# Altium schematic sheet FPGA.SchDoc
size A3; SheetNumber: 2; SheetTotal: 9
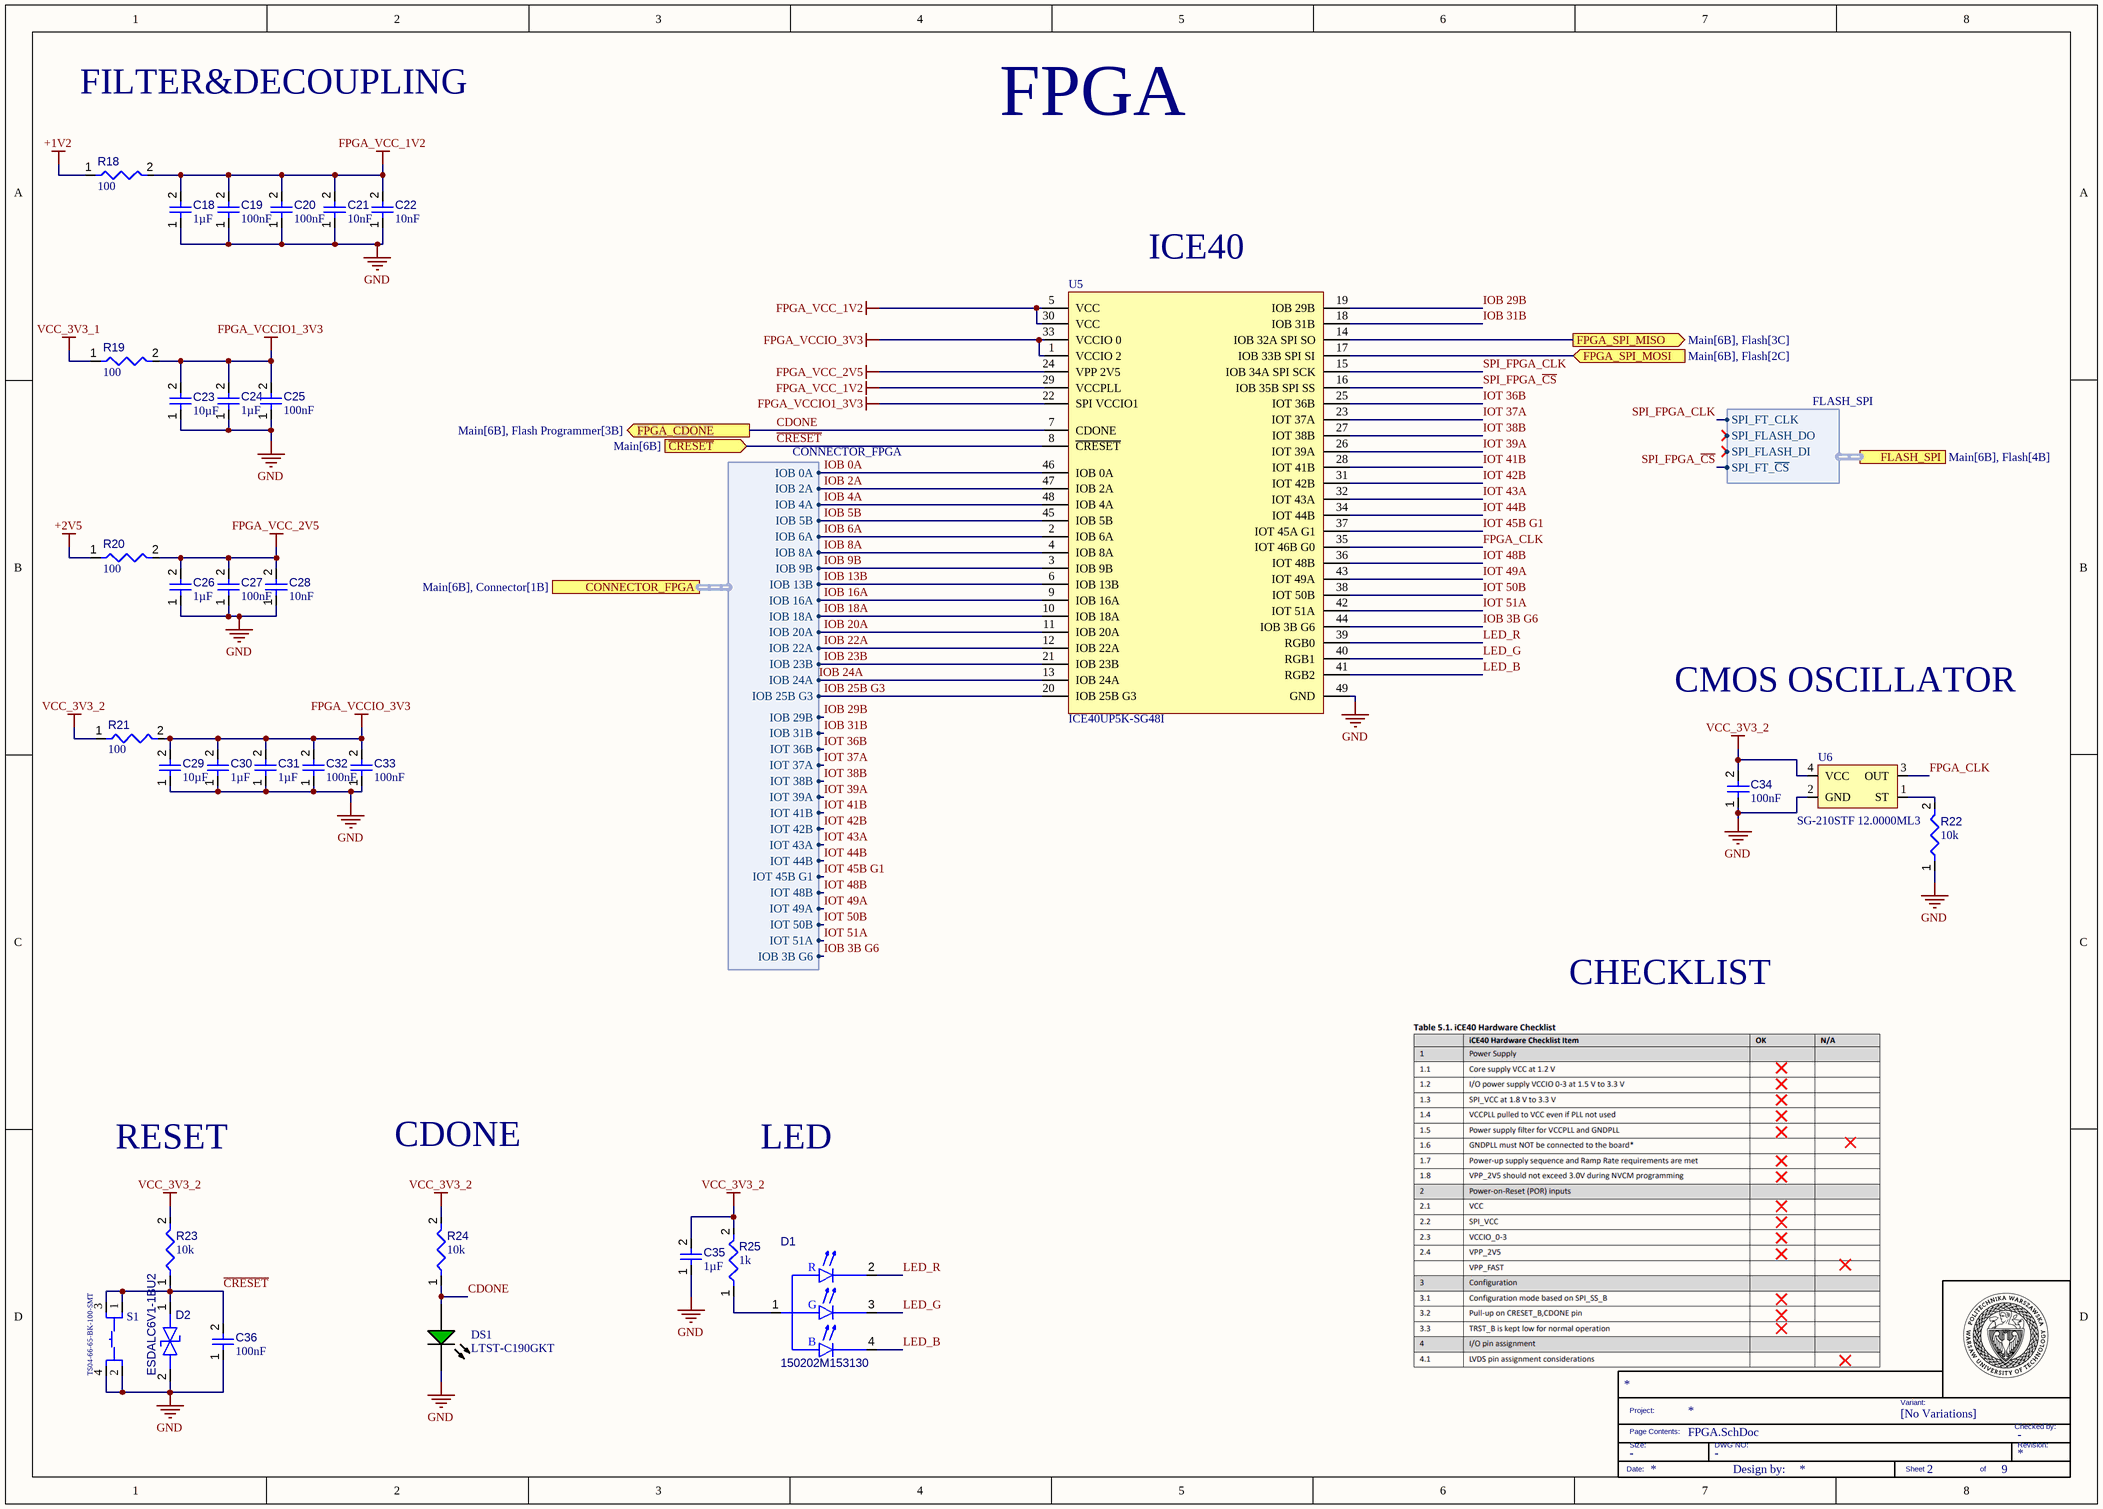
[diagram p0: FPGA.SchDoc]

## Parts
*?  TITLE_BLOCK  (value not drawn)  (graphical)
C18  value 1µF  [FP-CL10-IPC_C]  (hidden comment: CL10B105KA8NFNC)
C19  value 100nF  [FP-C0603C-CF-IPC_C]  (hidden comment: C0603C104K5RAC7411)
C20  value 100nF  [FP-C0603C-CF-IPC_C]  (hidden comment: C0603C104K5RAC7411)
C21  value 10nF  [CAPC1608X90X35LL10T15]  (hidden comment: GCM188R71H103KA37J)
C22  value 10nF  [CAPC1608X90X35LL10T15]  (hidden comment: GCM188R71H103KA37J)
C23  value 10µF  [FP-GRM188-0_2-IPC_C]  (hidden comment: GRM188R61C106MA73D)
C24  value 1µF  [FP-CL10-IPC_C]  (hidden comment: CL10B105KA8NFNC)
C25  value 100nF  [FP-C0603C-CF-IPC_C]  (hidden comment: C0603C104K5RAC7411)
C26  value 1µF  [FP-CL10-IPC_C]  (hidden comment: CL10B105KA8NFNC)
C27  value 100nF  [FP-C0603C-CF-IPC_C]  (hidden comment: C0603C104K5RAC7411)
C28  value 10nF  [CAPC1608X90X35LL10T15]  (hidden comment: GCM188R71H103KA37J)
C29  value 10µF  [FP-GRM188-0_2-IPC_C]  (hidden comment: GRM188R61C106MA73D)
C30  value 1µF  [FP-CL10-IPC_C]  (hidden comment: CL10B105KA8NFNC)
C31  value 1µF  [FP-CL10-IPC_C]  (hidden comment: CL10B105KA8NFNC)
C32  value 100nF  [FP-C0603C-CF-IPC_C]  (hidden comment: C0603C104K5RAC7411)
C33  value 100nF  [FP-C0603C-CF-IPC_C]  (hidden comment: C0603C104K5RAC7411)
C34  value 100nF  [FP-C0603C-CF-IPC_C]  (hidden comment: C0603C104K5RAC7411)
C35  value 1µF  [FP-CL10-IPC_C]  (hidden comment: CL10B105KA8NFNC)
C36  value 100nF  [FP-C0603C-CF-IPC_C]  (hidden comment: C0603C104K5RAC7411)
D1  150202M153130  [150202M153130-Footprint-1]
D2  ESDALC6V1-1BU2  [DIOC0603X03N]
DS1  LTST-C190GKT  [LTST-C190GKT_V]
R18  value 100  [RESC1608X06N]  (hidden comment: CRCW0603100RFKEAHP)
R19  value 100  [RESC1608X06N]  (hidden comment: CRCW0603100RFKEAHP)
R20  value 100  [RESC1608X06N]  (hidden comment: CRCW0603100RFKEAHP)
R21  value 100  [RESC1608X06N]  (hidden comment: CRCW0603100RFKEAHP)
R22  value 10k  [RESC1608X05N]  (hidden comment: CRCW060310K0FKTC)
R23  value 10k  [RESC1608X05N]  (hidden comment: CRCW060310K0FKTC)
R24  value 10k  [RESC1608X05N]  (hidden comment: CRCW060310K0FKTC)
R25  value 1k  [RESC1608X55X25LL10T15]  (hidden comment: Resistor 1k +/-1% 0603 100 mW)
S1  TS04-66-65-BK-100-SMT  [SW_TS04-66-65-BK-100-SMT]
U5  ICE40UP5K-SG48I  [FP-QFN-48-IPC_B]
U6  SG-210STF 12.0000ML3  [SG-210STF 12.0000ML3-Footprint-1]

## Ports
CONNECTOR_FPGA (harness CONNECTOR_FPGA, see Main[6B], Connector[1B]), FLASH_SPI (harness FLASH_SPI, see Main[6B], Flash[4B]), FPGA_CDONE (out, see Main[6B], Flash Programmer[3B]), FPGA_SPI_MISO (out, see Main[6B], Flash[3C]), FPGA_SPI_MOSI (in, see Main[6B], Flash[2C]), ~{CRESET} (in, see Main[6B])

## Harnesses
CONNECTOR_FPGA: IOB 0A, IOB 2A, IOB 4A, IOB 5B, IOB 6A, IOB 8A, IOB 9B, IOB 13B, IOB 16A, IOB 18A, IOB 20A, IOB 22A, IOB 23B, IOB 24A, IOB 25B G3, IOB 29B, IOB 31B, IOT 36B, IOT 37A, IOT 38B, IOT 39A, IOT 41B, IOT 42B, IOT 43A, IOT 44B, IOT 45B G1, IOT 48B, IOT 49A, IOT 50B, IOT 51A, IOB 3B G6
FLASH_SPI: SPI_FT_CLK, SPI_FLASH_DO, SPI_FLASH_DI, SPI_FT_~{CS}

## Nets
+1V2: R18.1
+2V5: R20.1
FPGA_VCC_1V2: C18.2 C19.2 C20.2 C21.2 C22.2 R18.2 U5.5(VCC) U5.29(VCCPLL) U5.30(VCC)
FPGA_VCC_2V5: C26.2 C27.2 C28.2 R20.2 U5.24(VPP_2V5)
FPGA_VCCIO1_3V3: C23.2 C24.2 C25.2 R19.2 U5.22(SPI_VCCIO1)
FPGA_VCCIO_3V3: C29.2 C30.2 C31.2 C32.2 C33.2 R21.2 U5.1(VCCIO_2) U5.33(VCCIO_0)
GND: C18.1 C19.1 C20.1 C21.1 C22.1 C23.1 C24.1 C25.1 C26.1 C27.1 C28.1 C29.1 C30.1 C31.1 C32.1 C33.1 C34.1 C35.1 C36.1 D2.2(A) DS1.2(K) R22.1 S1.2 S1.4 U5.49(GND) U6.2(GND)
VCC_3V3_1: R19.1
VCC_3V3_2: C34.2 C35.2 R21.1 R23.2 R24.2 R25.2 U6.4(VCC)
~{CRESET}: C36.2 D2.1(K) R23.1 S1.1 S1.3 U5.8(~{CRESET}) ; port ~{CRESET}
CDONE: DS1.1(A) R24.1 U5.7(CDONE) ; port FPGA_CDONE
FPGA_CLK: U5.35(IOT_46B_G0) U6.3(OUT)
FPGA_SPI_MISO: U5.14(IOB_32A_SPI_SO) ; port FPGA_SPI_MISO
FPGA_SPI_MOSI: U5.17(IOB_33B_SPI_SI) ; port FPGA_SPI_MOSI
IOB 0A: U5.46(IOB_0A) ; port CONNECTOR_FPGA.IOB 0A
IOB 2A: U5.47(IOB_2A) ; port CONNECTOR_FPGA.IOB 2A
IOB 3B G6: U5.44(IOB_3B_G6) ; port CONNECTOR_FPGA.IOB 3B G6
IOB 4A: U5.48(IOB_4A) ; port CONNECTOR_FPGA.IOB 4A
IOB 5B: U5.45(IOB_5B) ; port CONNECTOR_FPGA.IOB 5B
IOB 6A: U5.2(IOB_6A) ; port CONNECTOR_FPGA.IOB 6A
IOB 8A: U5.4(IOB_8A) ; port CONNECTOR_FPGA.IOB 8A
IOB 9B: U5.3(IOB_9B) ; port CONNECTOR_FPGA.IOB 9B
IOB 13B: U5.6(IOB_13B) ; port CONNECTOR_FPGA.IOB 13B
IOB 16A: U5.9(IOB_16A) ; port CONNECTOR_FPGA.IOB 16A
IOB 18A: U5.10(IOB_18A) ; port CONNECTOR_FPGA.IOB 18A
IOB 20A: U5.11(IOB_20A) ; port CONNECTOR_FPGA.IOB 20A
IOB 22A: U5.12(IOB_22A) ; port CONNECTOR_FPGA.IOB 22A
IOB 23B: U5.21(IOB_23B) ; port CONNECTOR_FPGA.IOB 23B
IOB 24A: U5.13(IOB_24A) ; port CONNECTOR_FPGA.IOB 24A
IOB 25B G3: U5.20(IOB_25B_G3) ; port CONNECTOR_FPGA.IOB 25B G3
IOB 29B: U5.19(IOB_29B) ; port CONNECTOR_FPGA.IOB 29B
IOB 31B: U5.18(IOB_31B) ; port CONNECTOR_FPGA.IOB 31B
IOT 36B: U5.25(IOT_36B) ; port CONNECTOR_FPGA.IOT 36B
IOT 37A: U5.23(IOT_37A) ; port CONNECTOR_FPGA.IOT 37A
IOT 38B: U5.27(IOT_38B) ; port CONNECTOR_FPGA.IOT 38B
IOT 39A: U5.26(IOT_39A) ; port CONNECTOR_FPGA.IOT 39A
IOT 41B: U5.28(IOT_41B) ; port CONNECTOR_FPGA.IOT 41B
IOT 42B: U5.31(IOT_42B) ; port CONNECTOR_FPGA.IOT 42B
IOT 43A: U5.32(IOT_43A) ; port CONNECTOR_FPGA.IOT 43A
IOT 44B: U5.34(IOT_44B) ; port CONNECTOR_FPGA.IOT 44B
IOT 45B G1: U5.37(IOT_45A_G1) ; port CONNECTOR_FPGA.IOT 45B G1
IOT 48B: U5.36(IOT_48B) ; port CONNECTOR_FPGA.IOT 48B
IOT 49A: U5.43(IOT_49A) ; port CONNECTOR_FPGA.IOT 49A
IOT 50B: U5.38(IOT_50B) ; port CONNECTOR_FPGA.IOT 50B
IOT 51A: U5.42(IOT_51A) ; port CONNECTOR_FPGA.IOT 51A
LED_B: D1.4(K) U5.41(RGB2)
LED_G: D1.3(K) U5.40(RGB1)
LED_R: D1.2(A) U5.39(RGB0)
SPI_FPGA_~{CS}: U5.16(IOB_35B_SPI_SS) ; port FLASH_SPI.SPI_FT_~{CS}
SPI_FPGA_CLK: U5.15(IOB_34A_SPI_SCK) ; port FLASH_SPI.SPI_FT_CLK
NetD1_1: D1.1(A) R25.1
NetR22_2: R22.2 U6.1(ST)

## Notes on the sheet
- FILTER&DECOUPLING
- FPGA
- (near U5) ICE40
- CMOS OSCILLATOR
- CHECKLIST
- RESET
- CDONE
- LED
- Rpullup=1/(2*ConfigFrequency*CDONETraceCap)
- CDONE IS 1 IF FPGA IS CONFIGURED
- (in symbol CMP-003-000005-7) Variant:; Project:; [No Variations]; Checked by:; Page Contents:; Size:; DWG NO:; Revision:; Date:; Design by:; Sheet; of
- (in symbol CMP-007-00037-1) R; G; B

## Library data of the parts
*? = CMP-003-000005-7: TITLEBLOCK; DWG NO: -; Size: -; Checked by: -; Design Item ID: TITLE_BLOCK; Source: TITLEBLOCK.SchLib
C18 C24 C26 C30 C31 C35 = CMP-001-00085-5: Ceramic Capacitor, Multilayer, Ceramic, 25V, 10% +Tol, 10% -Tol, X7R, 15% TC, 1uF, Surface Mount, 0603; Max Operating Temperature: 125°C; Pins: 2; RoHS Compliant: Yes; Min Operating Temperature: -55°C; Capacitor Type: Ceramic; Mounting Technology: Surface Mount; Case/Package: 0603
C19 C20 = CMP-001-00086-4: Ceramic Capacitor, Multilayer, Ceramic, 50V, 10% +Tol, 10% -Tol, X7R, 15% TC, 0.1uF, Surface Mount, 0603; Capacitor Type: Ceramic; Max Operating Temperature: 125°C; Case/Package: 0603; Pins: 2; Min Operating Temperature: -55°C; RoHS Compliant: Yes; Mounting Technology: Surface Mount
C21 C22 C28 = CMP-001-00231-2: Ceramic Capacitor, Multilayer, Ceramic, 50V, 10% +Tol, 10% -Tol, X7R, 15% TC, 0.01uF, Surface Mount, 0603; Min Operating Temperature: -55°C; Voltage Rating: 50V; Max Operating Temperature: 125°C; Tolerance: 10%; Capacitor Type: Ceramic; Mounting Technology: Surface Mount; RoHS Compliant: Yes; Case/Package: 0603; Pins: 2
C23 C29 = CMP-001-00241-5: Ceramic Capacitor, Multilayer, Ceramic, 16V, 20% +Tol, 20% -Tol, X5R, 15% TC, 10uF, Surface Mount, 0603; Min Operating Temperature: -55°C; Capacitor Type: Ceramic; RoHS Compliant: Yes; Max Operating Temperature: 85°C; Case/Package: 0603; Mounting Technology: Surface Mount; Pins: 2
C25 C27 C32-C34 C36 = CMP-001-00086-8: Ceramic Capacitor, Multilayer, Ceramic, 50V, 10% +Tol, 10% -Tol, X7R, 15% TC, 0.1uF, Surface Mount, 0603; Capacitor Type: Ceramic; Max Operating Temperature: 125°C; Case/Package: 0603; Pins: 2; Min Operating Temperature: -55°C; RoHS Compliant: Yes; Mounting Technology: Surface Mount
D1 = CMP-007-00037-1: Standard LEDs - SMD WL-SFTD Diffsd TopVw RGB 3.2V 20mA 635nm; Max Power Dissipation: 72mW; Min Operating Temperature: -40°C; Max Operating Temperature: 85°C; Pins: 4; Forward Voltage: 3.2V; Forward Current: 20mA; Colour: RGB; Nominal Vf: 3.2V
D2 = CMP-004-00032-2: Trans Voltage Suppressor Diode, Bidirectional, 1 Element, Silicon; Forward Current: 100nA; Peak Inverse Voltage: 6.1V; Forward Voltage: 3V; Max Surge Current: 1.5A; Max Operating Temperature: 125°C; Min Operating Temperature: -40°C; Case/Package: 0201; Pins: 2; RoHS Compliant: Yes
DS1 = CMP-007-00022-2: LED Uni-Color Green, 100 mW, 30 mA, -55 to 85 degC, 2-Pin SMD, RoHS, Tape and Reel; Manufacturer: Lite-On; Power: 100mW; Forward Voltage: 2.1V; Viewing Angle: 130degrees; Forward Current: 20mA; Luminous Intensity: 6mcd; Lens Style: Clear; Manufacturer URL: http://www.us.liteon.com/; RoHS Compliant: True; Colour: Green; Package Description: 2-Pin Surface Mount Device, Body 1.6 x 0.8 mm; Datasheet URL: http://datasheet.octopart.com/LTST-C190GKT-Lite-On-datasheet-158530.pdf; Datasheet Version: Dec-06; Mounting Technology: SM; Case/Package: 0603; Package Reference: C190GKT; Packaging: TapeandReel; Min Operating Temperature: -55°C; Nominal Vf: 2.1V; Package Quantity: 3000; Illumination Colour: Green; Max Operating Temperature: 85°C; Pins: 2
R18-R21 = CMP-009-00188-2: Fixed Resistor, Metal Glaze/thick Film, 0.33W, 100ohm, 75V, 1% +/-Tol, 100ppm/Cel, Surface Mount, 0603; Power: 250mW; Pins: 2; Case/Package: 0603; Max Operating Temperature: 155°C; Tolerance: 1%; Min Operating Temperature: -55°C; Mounting Technology: Surface Mount; RoHS Compliant: Yes
R22 R23 = CMP-009-00187-2: Fixed Resistor, Metal Glaze/thick Film, 0.1W, 10000ohm, 75V, 1% +/-Tol, 100ppm/Cel, Surface Mount, 0603; Power: 100mW; Voltage Rating: 75V; Case/Package: 0603; Tolerance: 1%; Min Operating Temperature: -55°C; Mounting Technology: Surface Mount; Max Operating Temperature: 155°C; RoHS Compliant: No; Pins: 2
R24 = CMP-009-00187-3: Fixed Resistor, Metal Glaze/thick Film, 0.1W, 10000ohm, 75V, 1% +/-Tol, 100ppm/Cel, Surface Mount, 0603; Power: 100mW; Voltage Rating: 75V; Case/Package: 0603; Tolerance: 1%; Min Operating Temperature: -55°C; Mounting Technology: Surface Mount; Max Operating Temperature: 155°C; RoHS Compliant: No; Pins: 2
R25 = CMP-009-00014-6: Chip Resistor, 1 KOhm, +/-1%, 0.1 W, -55 to 155 degC, 0603 (1608 Metric); Voltage Rating: 50V; Power: 100mW; Tolerance: 1%; Mounting Technology: SM; Pins: 2; Case/Package: 0603; Min Operating Temperature: -55°C; RoHS Compliant: True; Max Operating Temperature: 155°C
S1 = CMP-015-000000-3: Switch Tactile OFF (ON) SPST Round Button Gull Wing 0.05A 12VDC 100000Cycles 1N SMD Bag; Package: None; MP: TS04-66-65-BK-100-SMT; Availability: Unavailable; Source: TS04-66-65-BK-100-SMT.SchLib; Pin Count: 4; Design Item ID: TS04-66-65-BK-100-SMT; Value: *; Component Type: Standard; Price: None
U5 = CMP-020-00024-5: Field Programmable Gate Array; Min Supply Voltage: 1.2V; Max Supply Voltage: 3.6V; I/Os: 39; Clock Frequency: 50MHz; RoHS Compliant: Yes; Case/Package: QFN; Pins: 49; Frequency: 50MHz
U6 = CMP-003-00030-6: CMOS Output Clock Oscillator, 12MHz Nom; Load Capacitance: 15pF; Frequency: 12MHz; Max Operating Temperature: 85°C; Min Operating Temperature: -40°C; Pins: 4